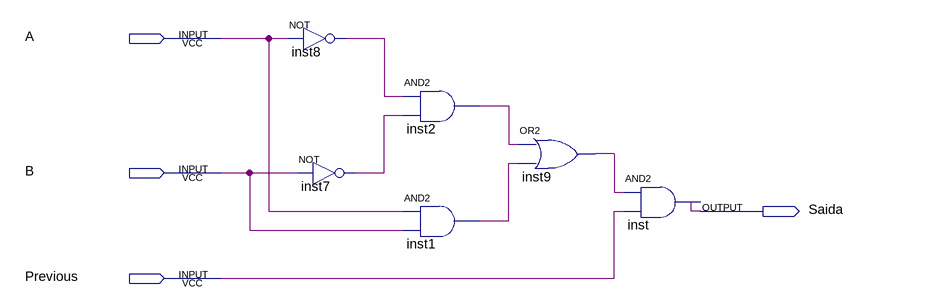
[diagram p0: schematic sheet]
// Quartus schematic Igualdade1Bit.bdf as structural Verilog: 6 symbols, 4 pins
module Igualdade1Bit (
  input  A,
  input  B,
  input  Previous,
  output Saida
);

  wire inst1_out, inst2_out, inst7_out, inst8_out, inst9_out;

  not inst8 (inst8_out, A);
  not inst7 (inst7_out, B);
  and inst2 (inst2_out, inst8_out, inst7_out);
  and inst1 (inst1_out, A, B);
  or inst9 (inst9_out, inst2_out, inst1_out);
  and inst (Saida, inst9_out, Previous);
endmodule
